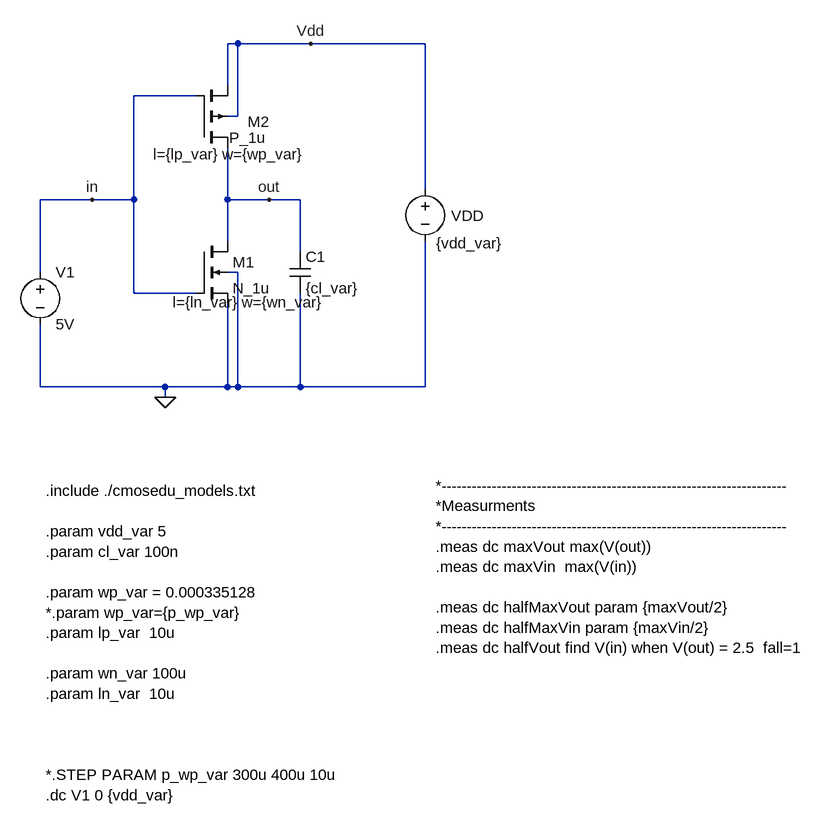
[diagram p0: schematic CMOS_INVERTER_01.asc]
CMOS_INVERTER_01.asc, the LTspice schematic file:
Version 4
SHEET 1 2948 2592
WIRE 928 -32 912 -32
WIRE 1040 -32 928 -32
WIRE 1216 -32 1040 -32
WIRE 912 32 912 -32
WIRE 864 48 768 48
WIRE 928 80 928 -32
WIRE 928 80 912 80
WIRE 1216 192 1216 -32
WIRE 704 208 624 208
WIRE 768 208 768 48
WIRE 768 208 704 208
WIRE 912 208 912 128
WIRE 976 208 912 208
WIRE 1024 208 976 208
WIRE 912 272 912 208
WIRE 1024 288 1024 208
WIRE 624 320 624 208
WIRE 928 320 912 320
WIRE 768 352 768 208
WIRE 864 352 768 352
WIRE 624 496 624 400
WIRE 816 496 624 496
WIRE 912 496 912 368
WIRE 912 496 816 496
WIRE 928 496 928 320
WIRE 928 496 912 496
WIRE 1024 496 1024 352
WIRE 1024 496 928 496
WIRE 1216 496 1216 272
WIRE 1216 496 1024 496
WIRE 816 512 816 496
FLAG 704 208 in
FLAG 816 512 0
FLAG 1040 -32 Vdd
FLAG 976 208 out
SYMBOL voltage 1216 176 R0
WINDOW 0 40 57 Left 2
WINDOW 3 17 99 Left 2
SYMATTR InstName VDD
SYMATTR Value {vdd_var}
SYMBOL nmos4 864 272 R0
WINDOW 123 -36 94 Left 2
SYMATTR Value2 l={ln_var} w={wn_var}
SYMATTR InstName M1
SYMATTR Value N_1u
SYMBOL pmos4 864 128 M180
WINDOW 0 79 40 Left 2
WINDOW 3 51 15 Left 2
WINDOW 123 -66 -10 Left 2
SYMATTR InstName M2
SYMATTR Value P_1u
SYMATTR Value2 l={lp_var} w={wp_var}
SYMBOL cap 1008 288 R0
SYMATTR InstName C1
SYMATTR Value {cl_var}
SYMBOL voltage 624 304 R0
SYMATTR InstName V1
SYMATTR Value 5V
TEXT 632 656 Left 2 !.include ./cmosedu_models.txt\n \n.param vdd_var 5\n.param cl_var 100n\n \n.param wp_var = 0.000335128\n*.param wp_var={p_wp_var}\n.param lp_var  10u\n \n.param wn_var 100u\n.param ln_var  10u\n \n \n \n*.STEP PARAM p_wp_var 300u 400u 10u\n.dc V1 0 {vdd_var}
TEXT 1232 648 Left 2 !*---------------------------------------------------------------------\n*Measurments\n*---------------------------------------------------------------------\n.meas dc maxVout max(V(out))\n.meas dc maxVin  max(V(in))\n \n.meas dc halfMaxVout param {maxVout/2}\n.meas dc halfMaxVin param {maxVin/2}\n.meas dc halfVout find V(in) when V(out) = 2.5  fall=1

The netlist it stands for:
* CMOS_INVERTER_01.asc
VDD Vdd 0 {vdd_var}
M1 out in 0 0 N_1u l={ln_var} w={wn_var}
M2 out in Vdd Vdd P_1u l={lp_var} w={wp_var}
C1 out 0 {cl_var}
V1 in 0 5V
.model NMOS NMOS
.model PMOS PMOS
.lib standard.mos
.include ./cmosedu_models.txt
.param vdd_var 5
.param cl_var 100n
.param wp_var = 0.000335128
*.param wp_var={p_wp_var}
.param lp_var  10u
.param wn_var 100u
.param ln_var  10u
*.STEP PARAM p_wp_var 300u 400u 10u
.dc V1 0 {vdd_var}
*---------------------------------------------------------------------
*Measurments
*---------------------------------------------------------------------
.meas dc maxVout max(V(out))
.meas dc maxVin  max(V(in))
.meas dc halfMaxVout param {maxVout/2}
.meas dc halfMaxVin param {maxVin/2}
.meas dc halfVout find V(in) when V(out) = 2.5  fall=1
.backanno
.end

* Results of the author's LTspice run, read from the files saved beside the schematic
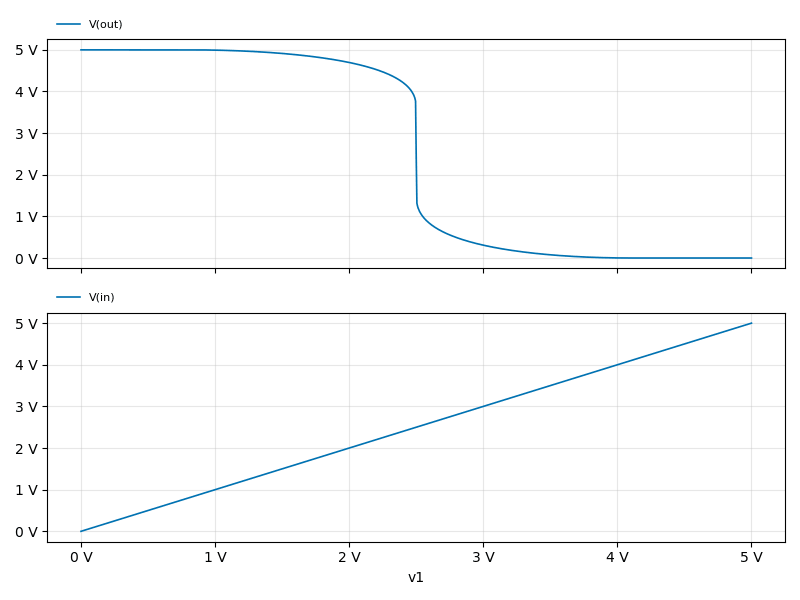
[diagram p1: DC transfer characteristic of CMOS_INVERTER_01.asc, plotted from the saved traces]
* DC transfer characteristic, 1 run:
*   V(out): 5 V at v1=0 V, 2.816 nV at v1=5 V, min 2.816 nV, max 5 V
*   V(in): 0 V at v1=0 V, 5 V at v1=5 V, min 0 V, max 5 V
* From the log:
*   maxvout: MAX(v(out))=5 FROM 0 TO 5
*   maxvin: MAX(v(in))=5 FROM 0 TO 5
*   halfmaxvout: (maxvout/2)=2.5
*   halfmaxvin: (maxvin/2)=2.5
*   halfvout: v(in)=2.49965 at 2.49965